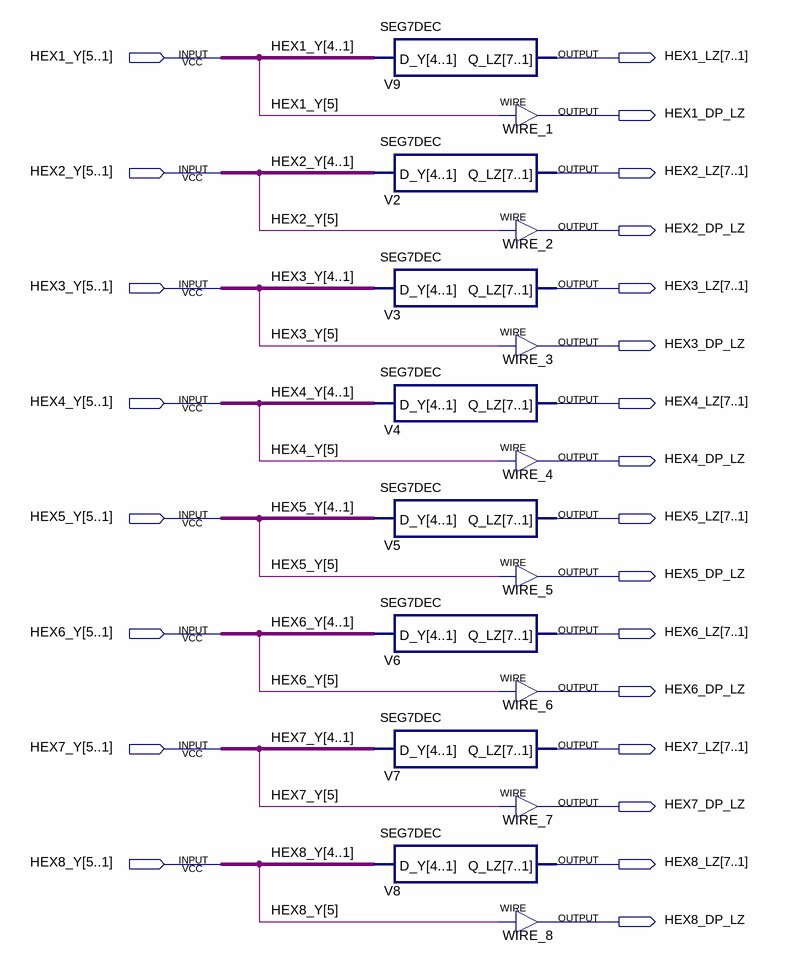
[diagram p0: schematic sheet]
// Quartus schematic DE270_7SEG.bdf as structural Verilog: 16 symbols, 24 pins
module DE270_7SEG (
  input  [5:1] HEX1_Y,
  input  [5:1] HEX2_Y,
  input  [5:1] HEX3_Y,
  input  [5:1] HEX4_Y,
  input  [5:1] HEX5_Y,
  input  [5:1] HEX6_Y,
  input  [5:1] HEX7_Y,
  input  [5:1] HEX8_Y,
  output [7:1] HEX1_LZ,
  output HEX1_DP_LZ,
  output [7:1] HEX2_LZ,
  output HEX2_DP_LZ,
  output [7:1] HEX3_LZ,
  output HEX3_DP_LZ,
  output [7:1] HEX4_LZ,
  output HEX4_DP_LZ,
  output [7:1] HEX5_LZ,
  output HEX5_DP_LZ,
  output [7:1] HEX6_LZ,
  output HEX6_DP_LZ,
  output [7:1] HEX7_LZ,
  output HEX7_DP_LZ,
  output [7:1] HEX8_LZ,
  output HEX8_DP_LZ
);

  SEG7DEC V9 (.D_Y(HEX1_Y[4:1]), .Q_LZ(HEX1_LZ));
  SEG7DEC V2 (.D_Y(HEX2_Y[4:1]), .Q_LZ(HEX2_LZ));
  SEG7DEC V3 (.D_Y(HEX3_Y[4:1]), .Q_LZ(HEX3_LZ));
  SEG7DEC V4 (.D_Y(HEX4_Y[4:1]), .Q_LZ(HEX4_LZ));
  SEG7DEC V5 (.D_Y(HEX5_Y[4:1]), .Q_LZ(HEX5_LZ));
  SEG7DEC V6 (.D_Y(HEX6_Y[4:1]), .Q_LZ(HEX6_LZ));
  SEG7DEC V7 (.D_Y(HEX7_Y[4:1]), .Q_LZ(HEX7_LZ));
  SEG7DEC V8 (.D_Y(HEX8_Y[4:1]), .Q_LZ(HEX8_LZ));
  assign HEX1_DP_LZ = HEX1_Y[5];  // WIRE WIRE_1
  assign HEX2_DP_LZ = HEX2_Y[5];  // WIRE WIRE_2
  assign HEX3_DP_LZ = HEX3_Y[5];  // WIRE WIRE_3
  assign HEX4_DP_LZ = HEX4_Y[5];  // WIRE WIRE_4
  assign HEX5_DP_LZ = HEX5_Y[5];  // WIRE WIRE_5
  assign HEX6_DP_LZ = HEX6_Y[5];  // WIRE WIRE_6
  assign HEX7_DP_LZ = HEX7_Y[5];  // WIRE WIRE_7
  assign HEX8_DP_LZ = HEX8_Y[5];  // WIRE WIRE_8
endmodule
